# EAGLE design moire_v1.4-wip (EAGLE 9.2.0)

## Sheet 1 of 2
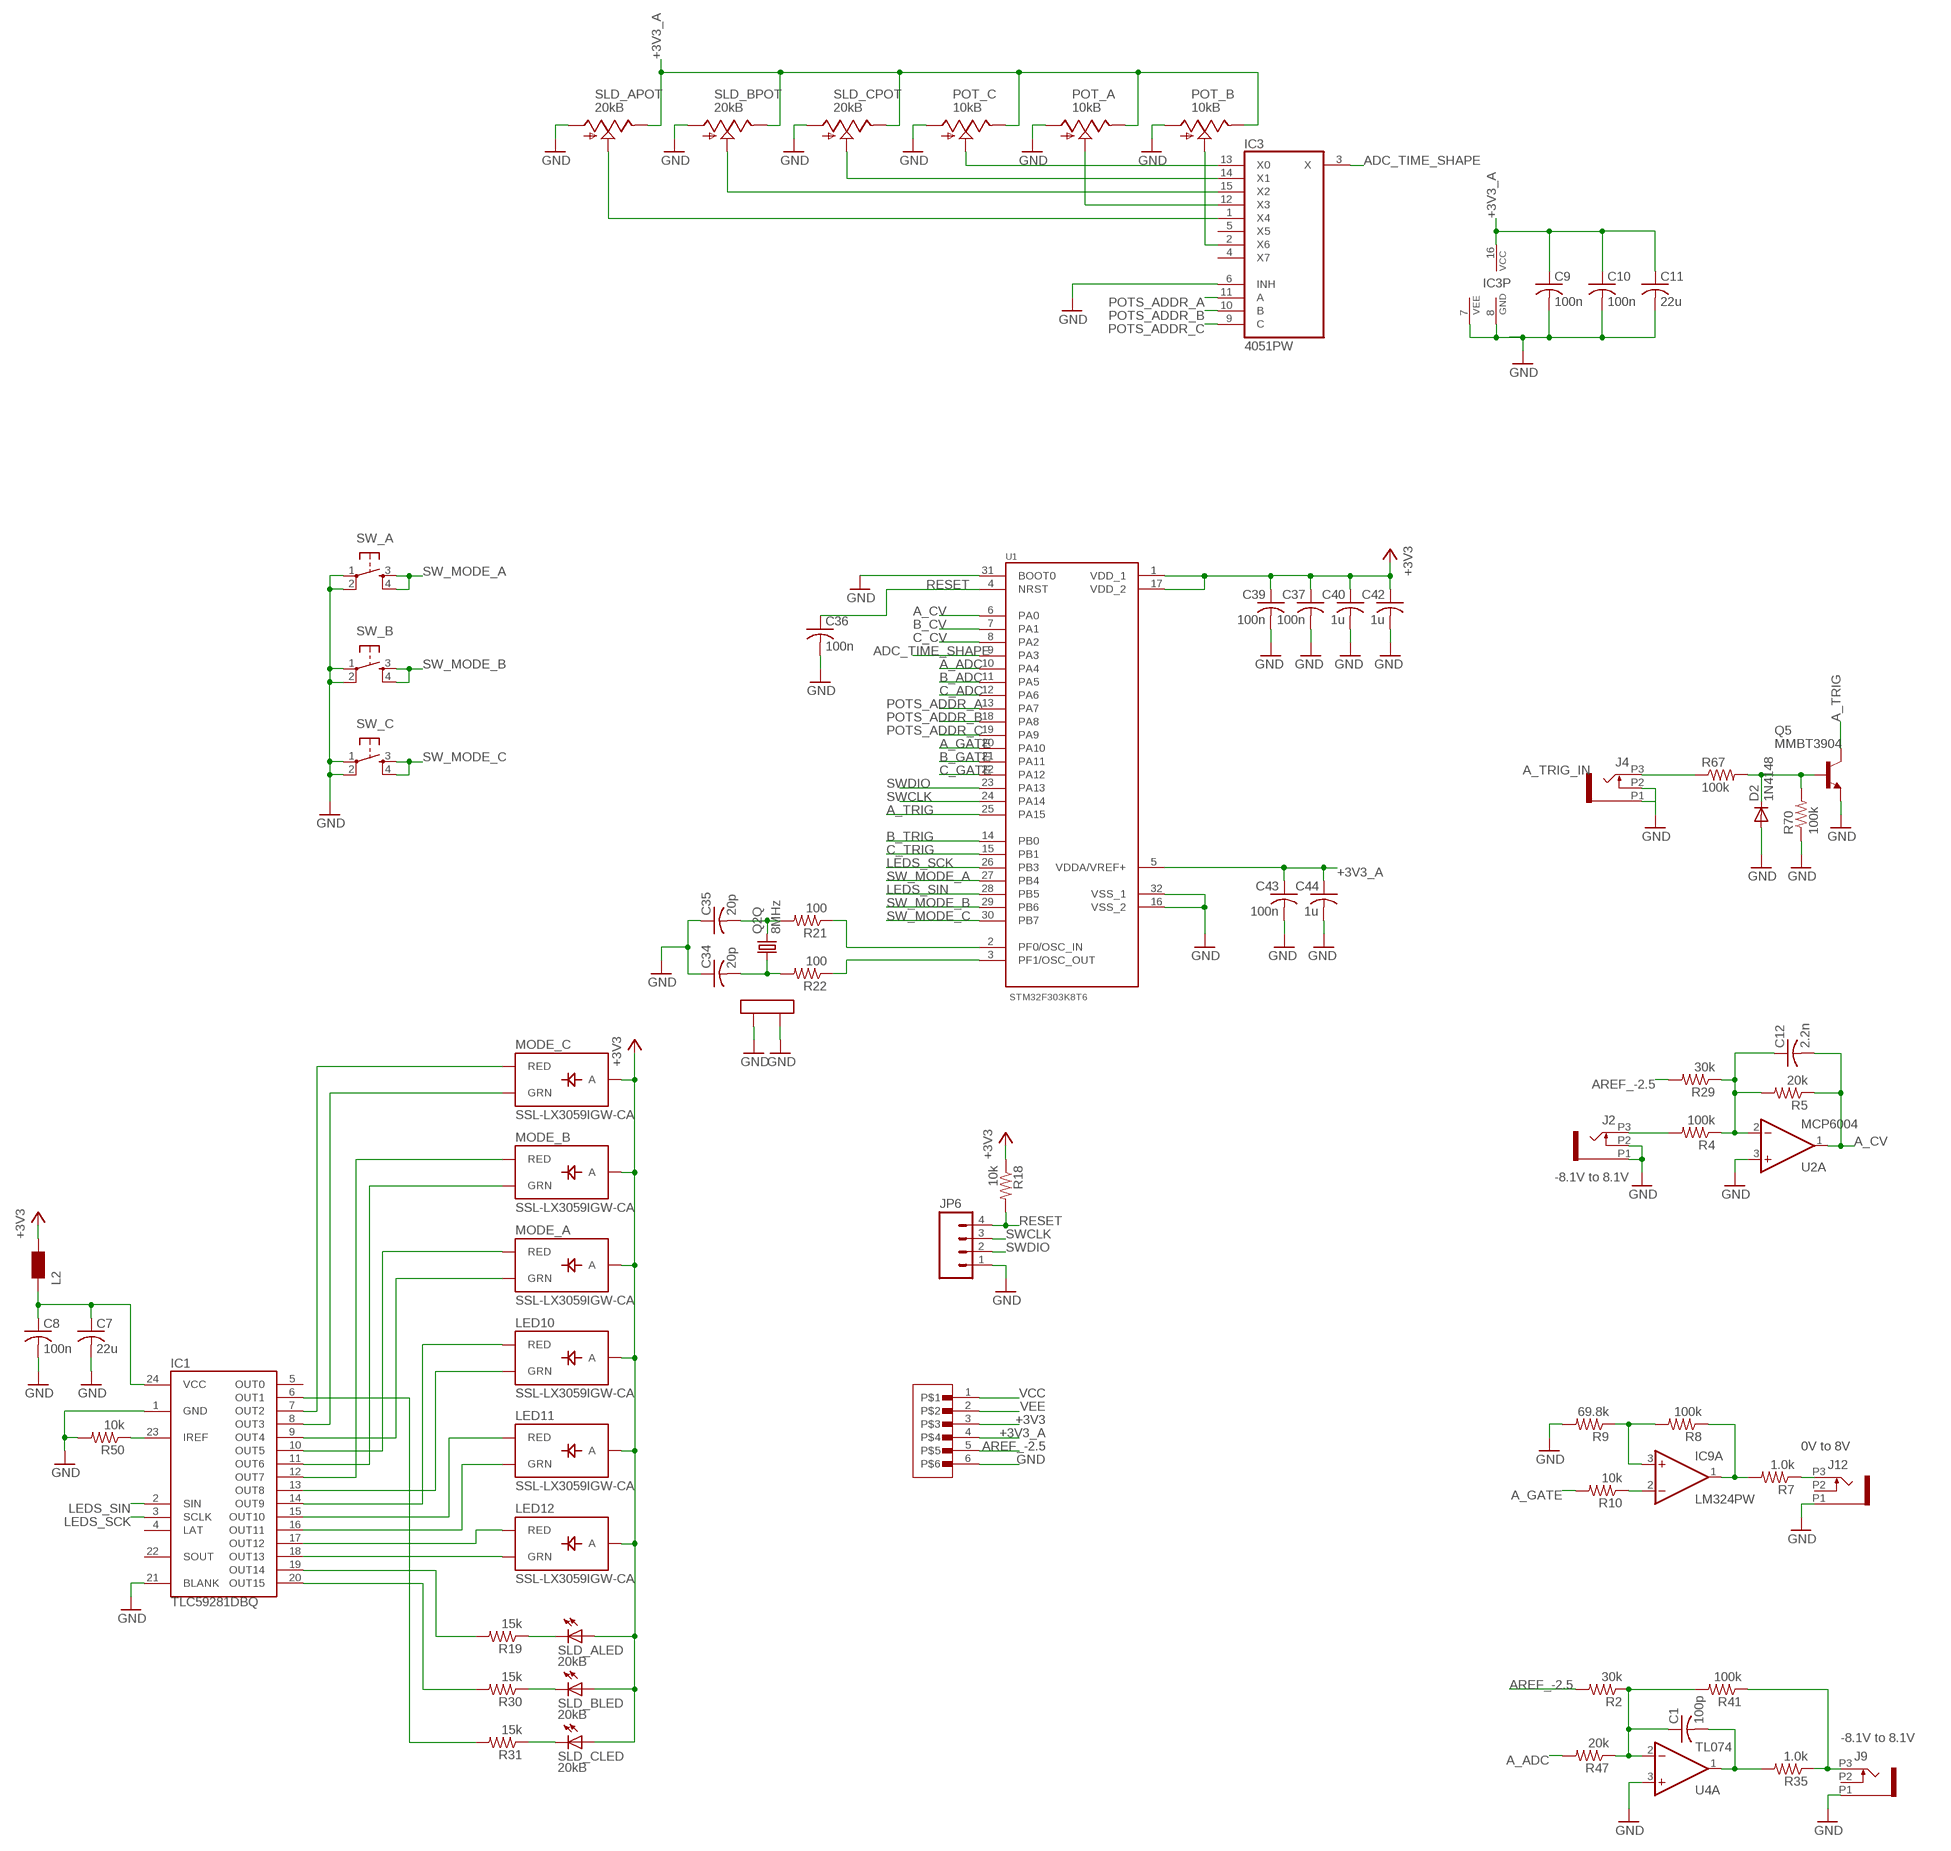
[diagram p0: schematic, sheet 1, part 1 of 2]
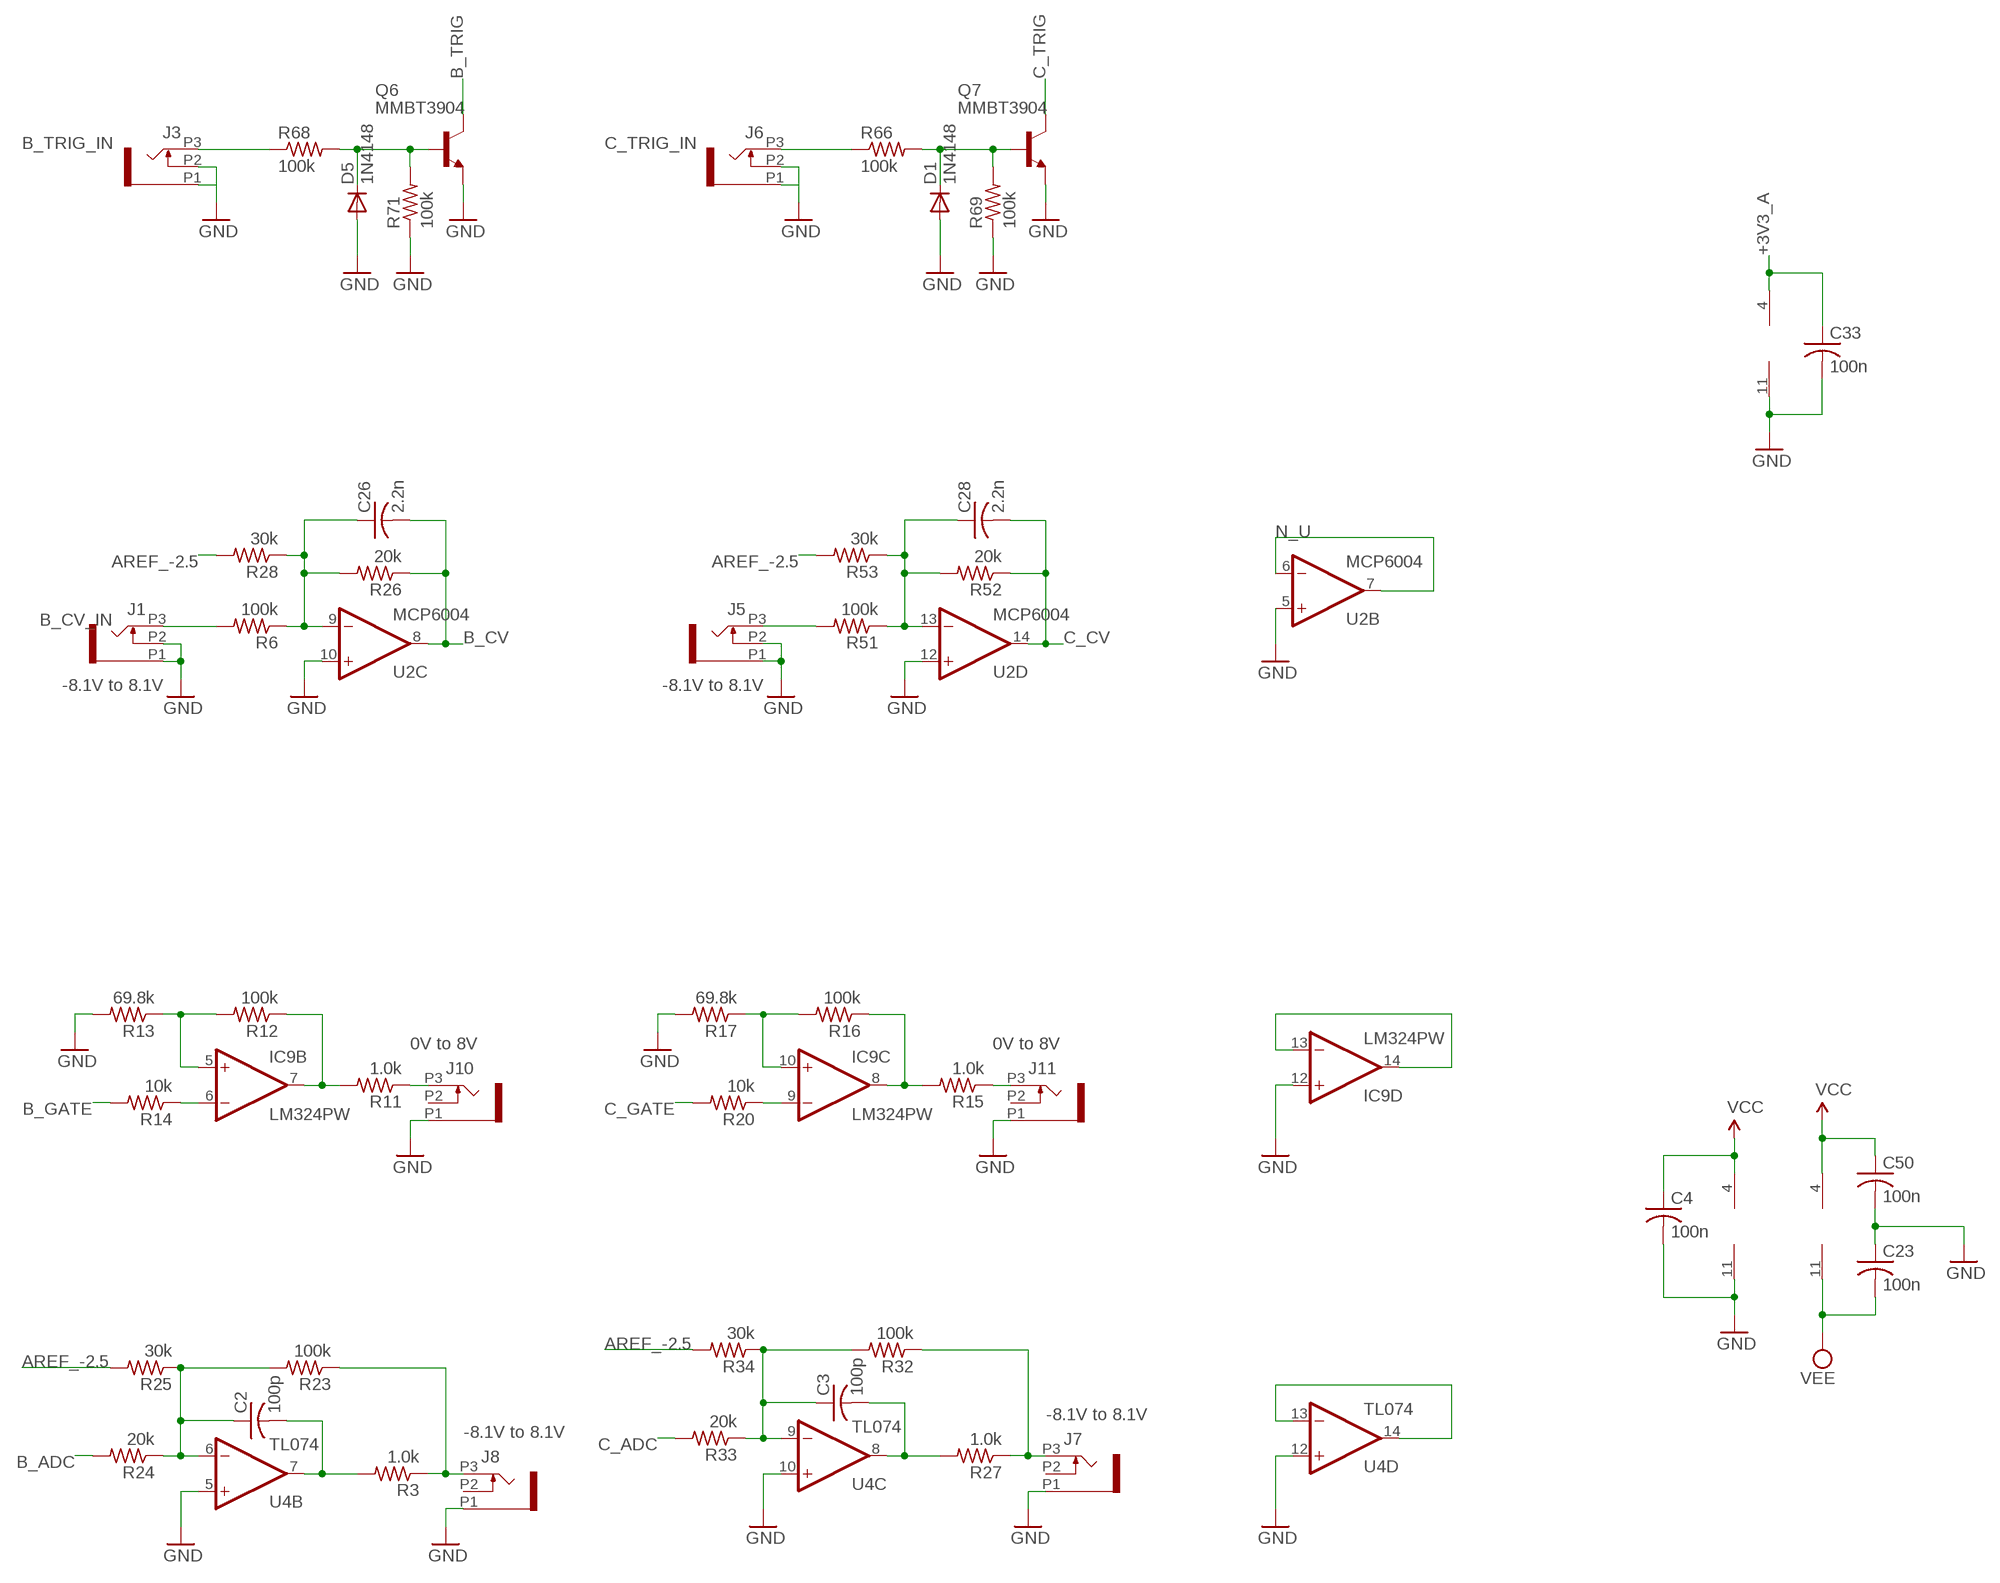
[diagram p1: schematic, sheet 1, part 2 of 2]

### Parts
C1  100p  C-USC0603  [C0603]
C2  100p  C-USC0603  [C0603]
C3  100p  C-USC0603  [C0603]
C4  100n  C-USC0603  [C0603]
C7  22u  C-USC1206  [C1206]
C8  100n  C-USC0603  [C0603]
C9  100n  C-USC0603  [C0603]
C10  100n  C-USC0603  [C0603]
C11  22u  C-USC1206  [C1206]
C12  2.2n  C-USC0603  [C0603]
C23  100n  C-USC0603  [C0603]
C26  2.2n  C-USC0603  [C0603]
C28  2.2n  C-USC0603  [C0603]
C33  100n  C-USC0603  [C0603]
C34  20p  C-USC0603  [C0603]
C35  20p  C-USC0603  [C0603]
C36  100n  C-USC0603  [C0603]
C37  100n  C-USC0603  [C0603]
C39  100n  C-USC0603  [C0603]
C40  1u  C-USC0603  [C0603]
C42  1u  C-USC0603  [C0603]
C43  100n  C-USC0603  [C0603]
C44  1u  C-USC0603  [C0603]
C50  100n  C-USC0603  [C0603]
D1  1N4148  DIODE-SOD523  [SOD523]
D2  1N4148  DIODE-SOD523  [SOD523]
D5  1N4148  DIODE-SOD523  [SOD523]
IC1  TLC59281DBQ  [TSSOP24_0635]
IC3  4051PW  [TSSOP16_065]
IC9  LM324PW  TL074PW  [TSSOP14_065]
J1  PJ301_THONKICONN6  [WQP_PJ_301M6]
J2  PJ301_THONKICONN6  [WQP_PJ_301M6]
J3  PJ301_THONKICONN6  [WQP_PJ_301M6]
J4  PJ301_THONKICONN6  [WQP_PJ_301M6]
J5  PJ301_THONKICONN6  [WQP_PJ_301M6]
J6  PJ301_THONKICONN6  [WQP_PJ_301M6]
J7  PJ301_THONKICONN6  [WQP_PJ_301M6]
J8  PJ301_THONKICONN6  [WQP_PJ_301M6]
J9  PJ301_THONKICONN6  [WQP_PJ_301M6]
J10  PJ301_THONKICONN6  [WQP_PJ_301M6]
J11  PJ301_THONKICONN6  [WQP_PJ_301M6]
J12  PJ301_THONKICONN6  [WQP_PJ_301M6]
JP6  M04PTH  [1X04]
L2  WE-CBF_0603  [0603]
LED10  SSL-LX3059IGW-CA  LED-BICOLOR-THROUGHHOLE-CA  [LED-BICOLOR-THROUGHHOLE-LUMEX]
LED11  SSL-LX3059IGW-CA  LED-BICOLOR-THROUGHHOLE-CA  [LED-BICOLOR-THROUGHHOLE-LUMEX]
LED12  SSL-LX3059IGW-CA  LED-BICOLOR-THROUGHHOLE-CA  [LED-BICOLOR-THROUGHHOLE-LUMEX]
MODE_A  SSL-LX3059IGW-CA  LED-BICOLOR-THROUGHHOLE-CA  [LED-BICOLOR-THROUGHHOLE-LUMEX]
MODE_B  SSL-LX3059IGW-CA  LED-BICOLOR-THROUGHHOLE-CA  [LED-BICOLOR-THROUGHHOLE-LUMEX]
MODE_C  SSL-LX3059IGW-CA  LED-BICOLOR-THROUGHHOLE-CA  [LED-BICOLOR-THROUGHHOLE-LUMEX]
POT_A  10kB  POT_USVERTICAL  [ALPS_POT_VERTICAL]
POT_B  10kB  POT_USVERTICAL  [ALPS_POT_VERTICAL]
POT_C  10kB  POT_USVERTICAL  [ALPS_POT_VERTICAL]
Q2  8MHz  CRYSTAL  [CTS406]
Q5  MMBT3904  MMBT3904LT1-NPN-SOT23-BEC  [SOT23-BEC]
Q6  MMBT3904  MMBT3904LT1-NPN-SOT23-BEC  [SOT23-BEC]
Q7  MMBT3904  MMBT3904LT1-NPN-SOT23-BEC  [SOT23-BEC]
R2  30k  R-US_R0603  [R0603]
R3  1.0k  R-US_R0603  [R0603]
R4  100k  R-US_R0603  [R0603]
R5  20k  R-US_R0603  [R0603]
R6  100k  R-US_R0603  [R0603]
R7  1.0k  R-US_R0603  [R0603]
R8  100k  R-US_R0603  [R0603]
R9  69.8k  R-US_R0603  [R0603]
R10  10k  R-US_R0603  [R0603]
R11  1.0k  R-US_R0603  [R0603]
R12  100k  R-US_R0603  [R0603]
R13  69.8k  R-US_R0603  [R0603]
R14  10k  R-US_R0603  [R0603]
R15  1.0k  R-US_R0603  [R0603]
R16  100k  R-US_R0603  [R0603]
R17  69.8k  R-US_R0603  [R0603]
R18  10k  R-US_R0603  [R0603]
R19  15k  R-US_R0603  [R0603]
R20  10k  R-US_R0603  [R0603]
R21  100  R-US_R0603  [R0603]
R22  100  R-US_R0603  [R0603]
R23  100k  R-US_R0603  [R0603]
R24  20k  R-US_R0603  [R0603]
R25  30k  R-US_R0603  [R0603]
R26  20k  R-US_R0603  [R0603]
R27  1.0k  R-US_R0603  [R0603]
R28  30k  R-US_R0603  [R0603]
R29  30k  R-US_R0603  [R0603]
R30  15k  R-US_R0603  [R0603]
R31  15k  R-US_R0603  [R0603]
R32  100k  R-US_R0603  [R0603]
R33  20k  R-US_R0603  [R0603]
R34  30k  R-US_R0603  [R0603]
R35  1.0k  R-US_R0603  [R0603]
R41  100k  R-US_R0603  [R0603]
R47  20k  R-US_R0603  [R0603]
R50  10k  R-US_R0603  [R0603]
R51  100k  R-US_R0603  [R0603]
R52  20k  R-US_R0603  [R0603]
R53  30k  R-US_R0603  [R0603]
R66  100k  R-US_R0603  [R0603]
R67  100k  R-US_R0603  [R0603]
R68  100k  R-US_R0603  [R0603]
R69  100k  R-US_R0603  [R0603]
R70  100k  R-US_R0603  [R0603]
R71  100k  R-US_R0603  [R0603]
SLD_A  20kB  BOURNS_SLIDER  [BOURNS_SLIDER]
SLD_B  20kB  BOURNS_SLIDER  [BOURNS_SLIDER]
SLD_C  20kB  BOURNS_SLIDER  [BOURNS_SLIDER]
SW_A  TAC_SWITCHPTH  [TACTILE-PTH]
SW_B  TAC_SWITCHPTH  [TACTILE-PTH]
SW_C  TAC_SWITCHPTH  [TACTILE-PTH]
U1  STM32F303K8T6  [QFP80P900X900X160-32N]
U2  MCP6004  MCP6004_SMD  [SO14]
U4  TL074  TL074_SMD  [SO14]
U$1  1X6-SMD-TESTPAD  [6X1-SMD-TESTPAD]

### Nets
+3V3: C37.1 C39.1 C40.1 C42.1 L2.2 LED10.A LED11.A LED12.A MODE_A.A MODE_B.A MODE_C.A R18.1 SLD_A.B(LED:A) SLD_B.B(LED:A) SLD_C.B(LED:A) U1.1(VDD_1) U1.17(VDD_2) U$1.3 ; also sheet 2
+3V3_A: C9.1 C10.1 C11.1 C33.1 C43.1 C44.1 IC3.16(VCC) POT_A.P$1(E) POT_B.P$1(E) POT_C.P$1(E) SLD_A.3(POT:E) SLD_B.3(POT:E) SLD_C.3(POT:E) U1.5(VDDA/VREF+) U2.4(P:V+) U$1.4 ; also sheet 2
A_ADC: R47.2 U1.10(PA4)
A_CV: C12.2 R5.1 U1.6(PA0) U2.1(A:OUT)
A_GATE: R10.2 U1.20(PA10)
A_TRIG: Q5.C U1.25(PA15)
A_TRIG_IN: J4.P3 R67.1
ADC_TIME_SHAPE: IC3.3(X) U1.9(PA3)
AREF_-2.5: R2.2 R25.2 R28.2 R29.2 R34.2 R53.2 U$1.5 ; also sheet 2
B_ADC: R24.2 U1.11(PA5)
B_CV: C26.2 R26.1 U1.7(PA1) U2.8(C:OUT)
B_CV_IN: J1.P3 R6.2
B_GATE: R14.2 U1.21(PA11)
B_TRIG: Q6.C U1.14(PB0)
B_TRIG_IN: J3.P3 R68.1
C_ADC: R33.2 U1.12(PA6)
C_CV: C28.2 R52.1 U1.8(PA2) U2.14(D:OUT)
C_GATE: R20.2 U1.22(PA12)
C_TRIG: Q7.C U1.15(PB1)
C_TRIG_IN: J6.P3 R66.1
GND: C4.2 C7.2 C8.2 C9.2 C10.2 C11.2 C23.1 C33.2 C34.1 C35.1 C36.2 C37.2 C39.2 C40.2 C42.2 C43.2 C44.2 C50.2 D1.A D2.A D5.A IC1.1(GND) IC1.21(BLANK) IC3.6(INH) IC3.7(VEE) IC3.8(GND) IC9.11(P:V-) IC9.12(D:+IN) J1.P1 J1.P2 J2.P1 J2.P2 J3.P1 J3.P2 J4.P1 J4.P2 J5.P1 J5.P2 J6.P1 J6.P2 J7.P1 J8.P1 J9.P1 J10.P1 J11.P1 J12.P1 JP6.1 POT_A.P$3(A) POT_B.P$3(A) POT_C.P$3(A) Q2.2(LID1) Q2.4(LID2) Q5.E Q6.E Q7.E R9.2 R13.2 R17.2 R50.2 R69.1 R70.1 R71.1 SLD_A.1(POT:A) SLD_B.1(POT:A) SLD_C.1(POT:A) SW_A.1 SW_A.2 SW_B.1 SW_B.2 SW_C.1 SW_C.2 U1.16(VSS_2) U1.31(BOOT0) U1.32(VSS_1) U2.3(A:+IN) U2.5(B:+IN) U2.10(C:+IN) U2.11(P:V-) U2.12(D:+IN) U4.3(A:+IN) U4.5(B:+IN) U4.10(C:+IN) U4.12(D:+IN) U$1.6 ; also sheet 2
LEDS_SCK: IC1.3(SCLK) U1.26(PB3)
LEDS_SIN: IC1.2(SIN) U1.28(PB5)
N$1: R31.1 SLD_C.E(LED:C)
N$2: J12.P3 R7.1
N$6: IC9.13(D:-IN) IC9.14(D:OUT)
N$7: J8.P3 R3.1 R23.1
N$8: C2.1 R23.2 R24.1 R25.1 U4.6(B:-IN)
N$9: R21.1 U1.2(PF0/OSC_IN)
N$10: R22.1 U1.3(PF1/OSC_OUT)
N$11: C35.2 Q2.3 R21.2
N$12: C34.2 Q2.1 R22.2
N$13: J10.P3 R11.1
N$14: U4.13(D:-IN) U4.14(D:OUT)
N$15: C2.2 R3.2 U4.7(B:OUT)
N$16: IC9.1(A:OUT) R7.2 R8.1
N$17: J7.P3 R27.1 R32.1
N$18: C3.1 R32.2 R33.1 R34.1 U4.9(C:-IN)
N$19: C3.2 R27.2 U4.8(C:OUT)
N$20: J11.P3 R15.1
N$21: J5.P3 R51.2
N$22: J2.P3 R4.2
N$24: IC9.3(A:+IN) R8.2 R9.1
N$25: IC9.2(A:-IN) R10.1
N$26: IC9.7(B:OUT) R11.2 R12.1
N$28: IC9.5(B:+IN) R12.2 R13.1
N$29: IC9.6(B:-IN) R14.1
N$30: IC9.8(C:OUT) R15.2 R16.1
N$32: IC1.11(OUT6) MODE_B.GREEN_C(GRN)
N$33: IC1.10(OUT5) MODE_A.RED_C(RED)
N$34: IC1.12(OUT7) MODE_B.RED_C(RED)
N$35: IC1.7(OUT2) MODE_C.RED_C(RED)
N$36: IC1.8(OUT3) MODE_C.GREEN_C(GRN)
N$37: IC1.15(OUT10) LED11.RED_C(RED)
N$38: IC1.16(OUT11) LED11.GREEN_C(GRN)
N$39: IC1.13(OUT8) LED10.GREEN_C(GRN)
N$40: IC1.17(OUT12) LED12.RED_C(RED)
N$41: D1.C Q7.B R66.2 R69.2
N$42: IC1.18(OUT13) LED12.GREEN_C(GRN)
N$43: IC1.14(OUT9) LED10.RED_C(RED)
N$44: C7.1 C8.1 IC1.24(VCC) L2.1
N$45: IC1.19(OUT14) R19.2
N$46: IC1.20(OUT15) R30.2
N$47: IC1.6(OUT1) R31.2
N$48: IC3.1(X4) SLD_A.2(POT:S)
N$49: R30.1 SLD_B.E(LED:C)
N$50: R19.1 SLD_A.E(LED:C)
N$51: IC3.2(X6) POT_B.P$2(S)
N$53: IC3.12(X3) POT_A.P$2(S)
N$54: IC3.13(X0) POT_C.P$2(S)
N$55: IC3.14(X1) SLD_C.2(POT:S)
N$56: IC3.15(X2) SLD_B.2(POT:S)
N$57: C12.1 R4.1 R5.2 R29.1 U2.2(A:-IN)
N$58: C26.1 R6.1 R26.2 R28.1 U2.9(C:-IN)
N$59: C28.1 R51.1 R52.2 R53.1 U2.13(D:-IN)
N$61: IC9.10(C:+IN) R16.2 R17.1
N$62: D5.C Q6.B R68.2 R71.2
N$64: IC9.9(C:-IN) R20.1
N$65: D2.C Q5.B R67.2 R70.2
N$68: IC1.23(IREF) R50.1
N$86: J9.P3 R35.1 R41.1
N$87: C1.1 R2.1 R41.2 R47.1 U4.2(A:-IN)
N$93: C1.2 R35.2 U4.1(A:OUT)
N$101: IC1.9(OUT4) MODE_A.GREEN_C(GRN)
N_U: U2.6(B:-IN) U2.7(B:OUT)
POTS_ADDR_A: IC3.11(A) U1.13(PA7)
POTS_ADDR_B: IC3.10(B) U1.18(PA8)
POTS_ADDR_C: IC3.9(C) U1.19(PA9)
RESET: C36.1 JP6.4 R18.2 U1.4(NRST)
SW_MODE_A: SW_A.3 SW_A.4 U1.27(PB4)
SW_MODE_B: SW_B.3 SW_B.4 U1.29(PB6)
SW_MODE_C: SW_C.3 SW_C.4 U1.30(PB7)
SWCLK: JP6.3 U1.24(PA14)
SWDIO: JP6.2 U1.23(PA13)
VCC: C4.1 C50.1 IC9.4(P:V+) U4.4(P:V+) U$1.1 ; also sheet 2
VEE: C23.2 U4.11(P:V-) U$1.2 ; also sheet 2
Unconnected: IC1.4(LAT) IC1.5(OUT0) IC1.22(SOUT) IC3.4(X7) IC3.5(X5) J7.P2 J8.P2 J9.P2 J10.P2 J11.P2 J12.P2

### Notes on the sheet
- -8.1V to 8.1V | -8.1V to 8.1V | -8.1V to 8.1V
- 0V to 8V | 0V to 8V | 0V to 8V
- -8.1V to 8.1V
- -8.1V to 8.1V | -8.1V to 8.1V

## Sheet 2 of 2
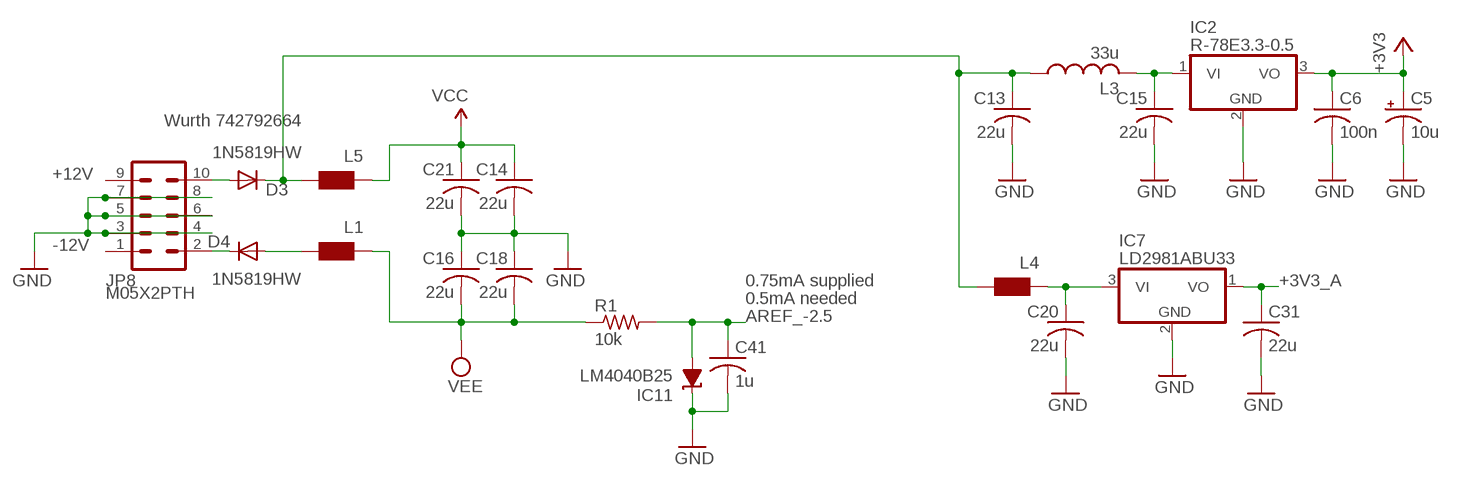
[diagram p2: schematic, sheet 2]

### Parts
C5  10u  CPOL-USA  [PANASONIC_A]
C6  100n  C-USC0603  [C0603]
C13  22u  C-USC1206  [C1206]
C14  22u  C-USC1206  [C1206]
C15  22u  C-USC1206  [C1206]
C16  22u  C-USC1206  [C1206]
C18  22u  C-USC1206  [C1206]
C20  22u  C-USC1206  [C1206]
C21  22u  C-USC1206  [C1206]
C31  22u  C-USC1206  [C1206]
C41  1u  C-USC0603  [C0603]
D3  1N5819HW  DIODE-SOD123  [SOD123]
D4  1N5819HW  DIODE-SOD123  [SOD123]
IC2  R-78E3.3-0.5  WE173950378  [WE78]
IC7  LD2981ABU33  LD2981ABU  [SOT89]
IC11  LM4040B25  LM4041B12DBZ  [DBZ_R-PDSO-G3]
JP8  M05X2PTH  [2X5-PTH]
L1  WE-CBF_0603  [0603]
L3  33u  L-USL2012C  [L2012C]
L4  WE-CBF_0603  [0603]
L5  WE-CBF_0603  [0603]
R1  10k  R-US_R0603  [R0603]

### Nets
+3V3: C5.+ C6.1 IC2.3(VO) ; also sheet 1
+3V3_A: C31.1 IC7.1(VO) ; also sheet 1
+12V: D3.A JP8.9 JP8.10
-12V: D4.C JP8.1 JP8.2
AREF_-2.5: C41.1 IC11.2(A) R1.2 ; also sheet 1
GND: C5.- C6.2 C13.2 C14.2 C15.2 C16.1 C18.1 C20.2 C21.2 C31.2 C41.2 IC2.2(GND) IC7.2(GND) IC11.1(C) JP8.3 JP8.4 JP8.5 JP8.6 JP8.7 JP8.8 ; also sheet 1
N$3: D4.A L1.2
N$4: C13.1 D3.C L3.1 L4.2 L5.2
N$5: C20.1 IC7.3(VI) L4.1
N$66: C15.1 IC2.1(VI) L3.2
VCC: C14.1 C21.1 L5.1 ; also sheet 1
VEE: C16.2 C18.2 L1.1 R1.1 ; also sheet 1

### Notes on the sheet
- Wurth 742792664
- 0.75mA supplied
- 0.5mA needed

## Library data of the parts
C1-C4 C6-C16 C18 C20 C21 C23 C26 C28 C31 C33-C37 C39-C44 C50 = rcl:C-US: CAPACITOR, American symbol
C5 = rcl:CPOL-US: POLARIZED CAPACITOR, American symbol
D1-D5 = diode:DIODE-: DIODE
IC1 = og-ics:TLC59281
IC2 = og-vreg:WE173950378
IC3 = og-ics:4051: 8-channel ANALOG MULTIPLEXER
IC7 = og-vreg:LD2981
IC9 = og-linear:TL074: OP AMP
IC11 = texas:LM4041: PRECISION MICROPOWER SHUNT VOLTAGE REFERENCE Source: http://focus.ti.com/lit/ds/slcs146e/slcs146e.pdf
J1-J12 = og-pj301_variations:PJ301_THONKICONN
JP6 = SparkFun:M04: Header 4 Standard 4-pin 0.1" header. Use with straight break away headers (SKU : PRT-00116), right angle break away headers (PRT-00553), swiss pins (PRT-00743), machine pins (PRT-00117), and female headers (PRT-00115). Molex polarized connector foot print use with SKU : PRT-08231 with associated crimp pins and housings.
JP8 = og-header:M05X2: Header 5x2 Standard 10-pin dual row 0.1" header. Commonly used with AVR-ISP. Use with Spark Fun Electronics SKU: PRT-00778
L1 L2 L4 L5 = wuerth-elektronik:WE-CBF: SMD EMI Suppression Ferrite Beads - excellent anti-EMI properties - low DCR - impedances till 3000 ohms - rated current up to 6 A
L3 = og-rcl:L-US
LED10-LED12 MODE_A MODE_B MODE_C = og-leds:LED-BICOLOR-THROUGHHOLE-CA
POT_A POT_B POT_C = og-pots:POT_US
Q2 = og-crystal:CRYSTAL: Crystal with 2 extra terminals for the metal LID (Abracon ABMM2 for example)
Q5-Q7 = transistor:*-NPN-: NPN Transistror BF959 corrected 2008.03.06
R1-R35 R41 R47 R50-R53 R66-R71 = rcl:R-US_: RESISTOR, American symbol
SLD_A SLD_B SLD_C = og-pots:BOURNS_SLIDER
SW_A SW_B SW_C = SparkFun:TAC_SWITCH: Momentary Switch Button commonly used for reset or general input. Spark Fun Electronics SKU : COM-00097
U1 = STM32F303K8T6:STM32F303K8T6: Analog and DSP with FPU ARM Cortex-M4 MCU with 64 Kbytes Flash, 72 MHz CPU, CCM, 12-bit ADC 5 MSPS, comparators, op-amp; AVAILABILITY: Unavailable; DESCRIPTION: Analog and DSP with FPU ARM Cortex-M4 MCU with 64 Kbytes Flash, 72 MHz CPU, CCM, 12-bit ADC 5 MSPS, comparators, op-amp; MF: STMicroelectronics; MP: STM32F303K8T6; PACKAGE: LQFP-32 STMicroelectronics; PRICE: None
U2 = MusicThingModular:MCP6004: Generic Quad Op Amp
U4 = MusicThingModular:TL074: Generic Quad Op Amp
U$1 = CUSTOM:1X6-SMD-TESTPAD

## Board
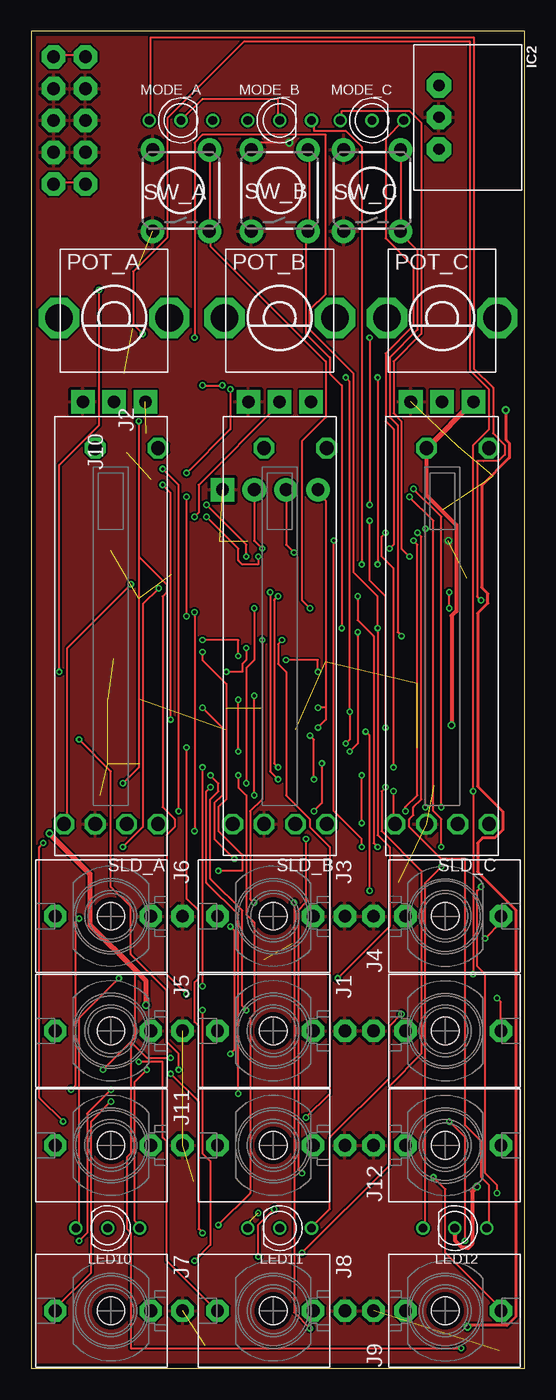
[diagram p3: board, top side]
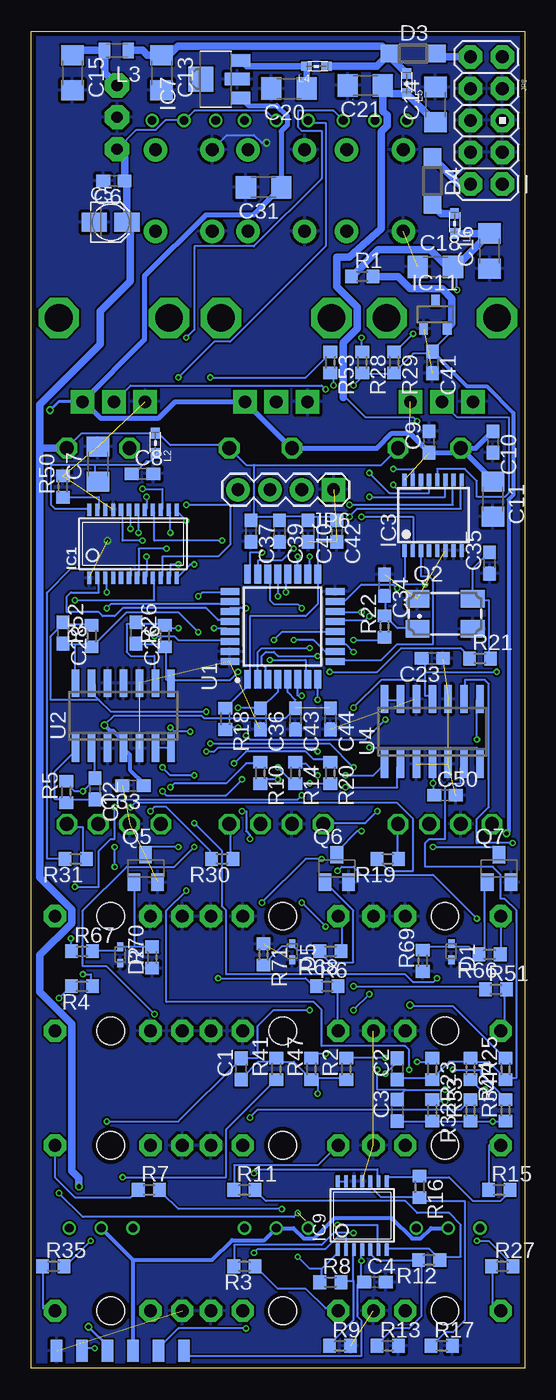
[diagram p4: board, bottom side, seen from below]

Size 39.35 x 106.68 mm. Coordinates in mm from the lower left corner, seen from the top.
Outline: 0,0 39.35,0 39.35,106.68 0,106.68 0,0
Copper layers (1*16): Top 0.035559375mm / dielectric 1.6mm / Bottom 0.035559375mm
Design rules "oshpark-2layer *": minimum track width 6mil, minimum drill 10mil, track to track 6mil, track to pad 6mil, pad to pad 6mil, via to via 6mil, smd to smd 0mil, copper to edge 15mil, drill to drill 6mil, minimum pad ring 5mil, minimum via ring 5mil, stop-mask expansion 2.5mil, vias tented up to drill 0mil, thermal gap 10mil

### Footprints (pad centres in the part's own frame; a part is rotated, then mirrored left to right if it is on the bottom)
C0603 = smd 1.1 x 1: 1 -0.85,0; 2 0.85,0
PANASONIC_A = smd 2 x 1.5: + 1.3,0; - -1.3,0
C1206 = smd 1.6 x 1.8: 1 -1.4,0; 2 1.4,0
SOD523 = smd 0.7 x 0.5: A 0.7,0; C -0.6,0
SOD123 = smd 1.4 x 1.4: A 1.9,0; C -1.9,0
TSSOP24_0635 = smd 0.33 x 1: 1 -3.493,-2.725; 2 -2.857,-2.725; 3 -2.223,-2.725; 4 -1.587,-2.725; 5 -0.953,-2.725; 6 -0.318,-2.725; 7 0.318,-2.725; 8 0.953,-2.725; 9 1.587,-2.725; 10 2.223,-2.725; 11 2.857,-2.725; 12 3.493,-2.725; 13 3.493,2.725; 14 2.857,2.725; 15 2.223,2.725; 16 1.587,2.725; 17 0.953,2.725; 18 0.318,2.725; 19 -0.318,2.725; 20 -0.953,2.725; 21 -1.587,2.725; 22 -2.223,2.725; 23 -2.857,2.725; 24 -3.493,2.725
WE78 = drill 0.9 pad 1.93 octagon: 1 -2.54,0; 2 0,0; 3 2.54,0
TSSOP16_065 = smd 0.35 x 1: 1 -1.95,-2.825; 2 -1.3,-2.825; 3 -0.65,-2.825; 4 0,-2.825; 5 0.65,-2.825; 6 1.3,-2.825; 7 1.95,-2.825; 8 2.6,-2.825; 9 2.6,2.825; 10 1.95,2.825; 11 1.3,2.825; 12 0.65,2.825; 13 0,2.825; 14 -0.65,2.825; 15 -1.3,2.825; 16 -1.95,2.825
SOT89 = smd 1 x 1.5: 1 -1.499,-1.981; 3 1.499,-1.981 | smd 1 x 2: 2 0,-1.727 | smd 2 x 2: 2@1 0,1.194
TSSOP14_065 = smd 0.305 x 0.991: 1 -1.95,-2.718; 2 -1.3,-2.718; 3 -0.65,-2.718; 4 0,-2.718; 5 0.65,-2.718; 6 1.3,-2.718; 7 1.95,-2.718; 8 1.95,2.718; 9 1.3,2.718; 10 0.65,2.718; 11 0,2.718; 12 -0.65,2.718; 13 -1.3,2.718; 14 -1.95,2.718
DBZ_R-PDSO-G3 = smd 0.7 x 1: 1 -0.95,-1.1; 2 0.95,-1.1; 3 0,1.1
WQP_PJ_301M6 = drill 1.016 pad 1.778 octagon: P1 0,-5.715; P2 0,-3.175; P3 0,4.445 | hole 2.2: 0,0
1X04 = drill 1.016 pad 1.88 square: 1 0,0 | drill 1.016 pad 1.88: 2 2.54,0; 3 5.08,0; 4 7.62,0
2X5-PTH = drill 1.016 pad 1.88 octagon: 1 -1.27,5.08; 2 1.27,5.08; 3 -1.27,2.54; 4 1.27,2.54; 5 -1.27,0; 6 1.27,0; 7 -1.27,-2.54; 8 1.27,-2.54; 9 -1.27,-5.08; 10 1.27,-5.08
0603 = smd 0.85 x 0.7: 1 -0.9,0; 2 0.7,0
L2012C = smd 0.9 x 1.25: 1 -0.9,0; 2 1,0
LED-BICOLOR-THROUGHHOLE-LUMEX = drill 0.7: A 0,0; GREEN_C 2.54,0; RED_C -2.54,0
ALPS_POT_VERTICAL = drill 1 pad 1.88 square: P$1 -2.5,6.7; P$2 0,6.7; P$3 2.5,6.7 | drill 2.2 pad 3.175 octagon: P$4 -4.4,0; P$5 4.4,0
CTS406 = smd 1.9 x 1.4: 1 -2.2,-1.2; 2 2.2,-1.2; 3 2.2,1.2; 4 -2.2,1.2
SOT23-BEC = smd 1 x 1.4: B -0.95,-1.1; C 0,1.1; E 0.95,-1.1
R0603 = smd 1 x 1.1: 1 -0.85,0; 2 0.85,0
BOURNS_SLIDER = drill 1.1 octagon: 1 -15,1.25; 2 -15,3.75; 3 15,1.25; B 15,-3.75; DUMMY -15,-1.25; E -15,-3.75
TACTILE-PTH = drill 1.016 pad 1.88: 1 -3.251,2.261; 2 3.251,2.261; 3 -3.251,-2.261; 4 3.251,-2.261
QFP80P900X900X160-32N = smd 1.5 x 0.55: 1 -4.2,2.8; 2 -4.2,2; 3 -4.2,1.2; 4 -4.2,0.4; 5 -4.2,-0.4; 6 -4.2,-1.2; 7 -4.2,-2; 8 -4.2,-2.8; 17 4.2,-2.8; 18 4.2,-2; 19 4.2,-1.2; 20 4.2,-0.4; 21 4.2,0.4; 22 4.2,1.2; 23 4.2,2; 24 4.2,2.8 | smd 0.55 x 1.5: 9 -2.8,-4.2; 10 -2,-4.2; 11 -1.2,-4.2; 12 -0.4,-4.2; 13 0.4,-4.2; 14 1.2,-4.2; 15 2,-4.2; 16 2.8,-4.2; 25 2.8,4.2; 26 2,4.2; 27 1.2,4.2; 28 0.4,4.2; 29 -0.4,4.2; 30 -1.2,4.2; 31 -2,4.2; 32 -2.8,4.2
SO14 = smd 0.6 x 2.2: 1 -3.81,-2.6; 2 -2.54,-2.6; 3 -1.27,-2.6; 4 0,-2.6; 5 1.27,-2.6; 6 2.54,-2.6; 7 3.81,-2.6; 8 3.81,2.6; 9 2.54,2.6; 10 1.27,2.6; 11 0,2.6; 12 -1.27,2.6; 13 -2.54,2.6; 14 -3.81,2.6
6X1-SMD-TESTPAD = smd 0.914 x 1.778: 1 0,0.123; 2 -2.032,0.123; 3 -4.064,0.123; 4 -6.096,0.123; 5 -8.128,0.123; 6 -10.16,0.123

### Placement (x,y rotation side)
C1  22.61,23.88 90 bottom
C2  10.16,23.88 90 bottom
C3  10.16,20.57 90 bottom
C4  11.94,6.86 0 bottom
C5  33.02,91.44 0 bottom
C6  32.77,94.74 180 bottom
C7  34.04,72.14 90 bottom
C8  30.48,71.37 0 bottom
C9  7.62,73.91 90 bottom
C10  2.54,73.91 270 bottom
C11  2.54,69.34 270 bottom
C12  34.29,46.23 270 bottom
C13  28.96,103.38 270 bottom
C14  7.11,100.84 90 bottom
C15  36.07,103.38 270 bottom
C16  2.79,89.15 90 bottom
C18  7.11,87.88 0 bottom
C20  18.8,102.11 180 bottom
C21  12.7,102.36 180 bottom
C23  7.37,56.64 180 bottom
C26  30.99,58.67 270 bottom
C28  36.83,58.67 270 bottom
C31  20.83,94.23 180 bottom
C33  31.24,46.48 180 bottom
C34  11.18,62.48 270 bottom
C35  2.79,64.26 90 bottom
C36  21.08,51.82 270 bottom
C37  21.84,66.8 270 bottom
C39  19.56,66.8 270 bottom
C40  17.27,66.8 270 bottom
C41  7.37,80.26 270 bottom
C42  14.99,66.8 270 bottom
C43  18.29,51.82 270 bottom
C44  15.49,51.82 270 bottom
C50  6.35,45.72 0 bottom
D1  5.84,33.27 270 bottom
D2  32.26,33.02 270 bottom
D3  8.89,104.9 0 bottom
D4  7.37,94.74 270 bottom
D5  18.54,33.27 270 bottom
IC1  31.24,65.79 0 bottom
IC2  32.51,99.82 270 top
IC3  7.62,68.07 0 bottom
IC7  24.64,102.87 90 bottom
IC9  12.95,12.19 0 bottom
IC11  7.11,84.07 0 bottom
J1  19.3,26.92 90 top
J2  33.02,26.92 270 top
J3  19.3,36.07 90 top
J4  33.02,36.07 270 top
J5  6.35,26.92 90 top
J6  6.35,36.07 90 top
J7  6.35,4.57 90 top
J8  19.3,4.57 90 top
J9  33.02,4.57 270 top
J10  19.3,17.78 90 top
J11  6.35,17.78 90 top
J12  33.02,17.78 270 top
JP6  15.24,70.1 180 bottom
JP8  3.05,99.57 180 bottom
L1  5.59,91.44 90 bottom
L2  29.46,73.91 90 bottom
L3  32.51,105.16 180 bottom
L4  16.51,103.89 0 bottom
L5  9.4,102.62 90 bottom
LED10  6.1,11.18 0 top
LED11  19.81,11.18 0 top
LED12  33.78,11.18 0 top
MODE_A  11.94,99.57 180 top
MODE_B  19.81,99.57 180 top
MODE_C  27.18,99.57 180 top
POT_A  6.6,83.82 180 top
POT_B  19.81,83.82 180 top
POT_C  32.77,83.82 180 top
Q2  6.35,60.2 0 bottom
Q5  30.23,39.88 0 bottom
Q6  14.99,39.88 0 bottom
Q7  2.03,39.88 0 bottom
R1  12.95,87.12 0 bottom
R2  14.22,23.88 90 bottom
R3  22.35,8.13 180 bottom
R4  35.31,30.48 180 bottom
R5  36.58,45.97 90 bottom
R6  15.75,30.48 0 bottom
R7  29.97,14.22 0 bottom
R8  15.49,6.86 0 bottom
R9  14.73,1.78 0 bottom
R10  21.08,47.5 270 bottom
R11  22.35,14.22 0 bottom
R12  7.62,8.64 180 bottom
R13  10.92,1.78 0 bottom
R14  18.29,47.5 270 bottom
R15  2.03,14.22 0 bottom
R16  8.38,14.48 270 bottom
R17  6.6,1.78 0 bottom
R18  23.88,51.82 270 bottom
R19  10.92,40.64 180 bottom
R20  15.49,47.5 270 bottom
R21  3.56,56.64 0 bottom
R22  11.18,59.18 90 bottom
R23  7.37,23.88 270 bottom
R24  4.32,23.88 270 bottom
R25  1.52,23.88 90 bottom
R26  28.7,58.42 90 bottom
R27  1.78,8.13 0 bottom
R28  12.95,80.26 270 bottom
R29  10.41,80.26 270 bottom
R30  24.13,40.64 180 bottom
R31  35.81,40.64 180 bottom
R32  7.37,20.57 270 bottom
R33  4.32,20.57 90 bottom
R34  1.52,20.57 90 bottom
R35  37.59,8.13 0 bottom
R41  19.81,23.88 90 bottom
R47  17.02,23.88 90 bottom
R50  36.83,70.36 90 bottom
R51  2.29,30.23 0 bottom
R52  34.54,58.42 90 bottom
R53  15.49,80.26 270 bottom
R66  2.79,33.02 180 bottom
R67  35.31,33.27 0 bottom
R68  15.49,33.27 180 bottom
R69  8.13,32.51 90 bottom
R70  29.72,32.77 90 bottom
R71  20.83,33.02 270 bottom
SLD_A  6.35,58.42 90 top
SLD_B  19.81,58.42 90 top
SLD_C  32.77,58.42 90 top
SW_A  11.94,93.98 90 top
SW_B  19.81,93.98 90 top
SW_C  27.18,93.98 90 top
U1  19.3,59.18 90 bottom
U2  32,52.07 0 bottom
U4  7.37,50.8 0 bottom
U$1  27.18,1.27 0 bottom

### Tracks (layer width: path | path; a pad name or v marks a point on that pad's centre or on a via)
+3V3  (via drill 0.35)  (1 unrouted)
  Top 0.152: 13.72,101.28 19.68,101.28 19.68,99.69 MODE_B.A | 35.56,14.61 v35.56,14.48 | 13.65,101.28 MODE_A.A
  Top 0.305: v35.56,14.48 35.17,14.08 35.17,9.93 34.84,9.6 34.38,9.6 33.78,10.2 LED12.A
  Bottom 0.152: 31.43,1.59 U$1.3 | R18.1 23.81,52.7 21.91,54.61 21.91,54.93 U1.1 21.91,55.24 21.91,60.01 17.46,60.01 16.51,60.96 16.51,63.18 U1.17 16.51,63.5 16.51,67.94 | 21.59,67.94 19.68,67.94 C39.1 19.37,67.94 17.46,67.94 C40.1 17.14,67.94 16.51,67.94 | 16.51,67.94 15.24,67.94 C42.1 | L2.2 29.21,74.61 28.26,73.66 23.81,73.66 SLD_B.B 23.5,73.34 22.23,72.07 21.59,72.07 | 21.59,72.07 11.43,72.07 10.16,73.34 SLD_A.B | 21.59,72.07 21.59,67.94 | 21.59,67.94 C37.1 | 29.53,74.93 L2.2 | SLD_C.B 35.32,74.61 L2.2 | IC2.3 30.98,98.81 29.41,98.81 28.65,99.57 MODE_C.A 26.99,99.69 26.35,100.33 20.64,100.33 20,99.69 19.94,99.69 MODE_B.A
  Bottom 0.305: LED12.A 31.24,8.64 | 31.24,8.64 U$1.3 | 31.24,8.64 24.92,8.64 23.34,10.22 20.77,10.22 LED11.A 18.45,11.18 17.62,10.35 16.8,10.35 15.15,11.99 10.62,11.99 8.98,10.35 8.29,10.35 7.46,11.18 LED10.A
  Bottom 0.61: 38.66,73.41 38.66,39.17 36.12,36.63 36.12,35.51 38.66,32.97 38.66,30.03 36.12,27.48 36.12,15.75 35.56,15.19 v35.56,14.48 | 38.66,73.41 36.53,73.41 SLD_C.B | IC2.3 31.92,96.69 C6.1 31.72,94.55 C5.+ 31.47,91.19 31.47,86.76 33.87,84.36 33.87,81.7 38.66,76.91 38.66,73.41
+3V3_A  (via drill 0.35)  (3 unrouted)
  Top 0.254: v37.85,76.45 37.85,74.1 38.14,73.81 38.14,72.66 35.92,70.43 35.92,62.31 36.41,61.81 36.41,61.06 35.6,60.24 35.6,46.44 37.62,44.41 37.62,42.96 36.97,42.32 36,42.32 35.6,41.91 35.6,39.61 38.63,36.58 38.63,4.09 37.95,3.4 34.9,3.4 v34.8,3.3
  Top 0.305: SLD_C.3 31.52,69.67 33.9,67.29 33.9,60.41 33.53,60.04 v33.53,51.31
  Top 0.406: POT_C.P$1 31.57,73.42 SLD_C.3
  Bottom 0.152: v33.53,51.31 32.75,52.08 25.78,52.08 25.58,51.89 19.07,51.89 C43.1 18.29,53.34 18.9,53.96 U1.5
  Bottom 0.254: POT_C.P$1 37.18,77.12 v37.85,76.45 | v34.8,3.3 33.27,1.78 U$1.4
  Bottom 0.305: v33.53,51.31 33.09,50.88 32.85,50.88 32,50.03 U2.4 31.5,48.96 31.5,47.75 30.39,46.65 C33.1
  Bottom 0.406: IC7.1 22.05,100.76 19.76,100.76 18.93,99.93 18.93,99.2 19.43,98.71 C31.1 21.64,92.02 25.45,92.02 30.33,87.15 30.33,82.06 POT_C.P$1 35.15,77.12 33.85,75.83 29.18,75.83 27.88,77.12 POT_B.P$1 18.61,73.42 SLD_B.3 11.77,73.42 10.59,74.6 9.16,74.6 C9.1 5.46,73.06 SLD_A.3 | SLD_A.3 3.88,73.42 C10.1 | SLD_A.3 2.54,70.86 C11.1
+12V
  Top 0.152: JP8.9 1.91,104.78 4.13,104.78 JP8.10
  Bottom 0.61: JP8.10 6.74,104.65 D3.A
-12V
  Top 0.152: JP8.1 1.91,94.61 4.13,94.61 JP8.2
  Bottom 0.61: JP8.2 5.21,94.49 D4.C
A_ADC  (via drill 0.25)
  Top 0.152: v15.88,25.08 16.19,25.4 16.19,34.92 v15.88,35.24 | v17.78,37.15 17.46,37.47 17.46,44.45 18.41,45.4 v18.41,58.1
  Bottom 0.152: v15.88,25.08 16.51,25.08 16.83,24.77 R47.2 | v17.78,37.15 v15.88,35.24 | v18.41,58.1 16.83,58.1 15.88,57.15 15.24,57.15 U1.10
A_CV  (via drill 0.25)
  Top 0.152: v17.78,45.72 v17.78,53.66
  Bottom 0.152: 34.29,45.4 36.51,45.4 R5.1 36.83,45.4 37.47,45.4 37.47,47.62 35.88,49.21 U2.1 | v17.78,53.66 18.1,53.66 18.1,54.93 U1.6 | v17.78,45.72 18.1,45.4 34.29,45.4 | 34.29,45.4 C12.2
A_GATE  (via drill 0.25)
  Top 0.152: v19.68,46.99 19.05,47.62 v19.05,61.91
  Bottom 0.152: v19.68,46.99 20.64,46.99 20.95,46.67 R10.2 | v19.05,61.91 19.05,63.18 U1.20
A_TRIG  (via drill 0.25)
  Top 0.152: v27.62,41.59 27.3,41.91 27.3,58.42 26.04,59.69 v26.04,61.59
  Bottom 0.152: v27.62,41.59 29.84,41.59 30.16,41.27 Q5.C | v26.04,61.59 25.72,61.91 23.81,61.91 U1.25
A_TRIG_IN  (via drill 0.25)
  Top 0.152: v36.2,34.29 37.47,35.56 J4.P3
  Bottom 0.152: v36.2,34.29 36.2,33.34 R67.1
ADC_TIME_SHAPE
  Bottom 0.152: IC3.3 8.26,65.09 8.26,63.18 7.62,63.18 7.3,62.87 7.3,57.78 10.16,57.78 11.43,56.52 14.92,56.52 U1.9
AREF_-2.5  (via drill 0.25, 0.35)
  Top 0.152: v13.65,78.42 v15.24,78.42 | 7.94,26.04 8.26,26.35 8.26,31.75 8.27,31.77 | 7.94,26.04 v5.71,23.81 | v11.11,24.77 9.21,24.77 7.94,26.04 | v34.29,1.59 7.94,1.59 7.94,10.79 7.62,11.11 7.62,16.83 7.94,17.14 7.94,26.04
  Top 0.406: v1.45,42.67 4.67,39.45 4.67,35.37 8.27,31.77 9.14,30.89 v9.14,28.96
  Bottom 0.152: 12.7,79.38 10.48,79.38 R29.2 10.16,79.69 8.89,80.96 7.62,80.96 C41.1 7.3,81.28 6.03,82.55 IC11.2 | v15.24,78.42 15.24,79.38 R53.2 | 12.7,79.38 v13.65,78.42 | 12.7,79.38 R28.2 | v5.71,23.81 3.49,23.81 3.49,23.5 1.59,21.59 R34.2 | R25.2 1.59,24.77 5.71,28.89 8.89,28.89 v9.14,28.96 | v11.11,24.77 13.97,24.77 R2.2 | v34.29,1.59 35.24,1.59 U$1.5
  Bottom 0.305: C41.1 4.62,78.36 3.04,78.36 0.89,76.22 0.89,69.69 1.27,69.31 1.27,42.85 v1.45,42.67
  Bottom 0.61: R1.2 10.1,87.12 9.11,86.13 6.57,86.13 5.8,85.36 5.8,83.34 IC11.2
B_ADC  (via drill 0.25)
  Top 0.152: v3.17,22.23 3.49,22.54 3.49,35.56 v3.81,35.88 | v14.92,39.69 16.83,39.69 16.83,40.96 14.92,42.86 14.92,44.77 15.56,45.4 15.56,54.61 13.65,56.52 v13.65,57.15
  Bottom 0.152: v3.17,22.23 3.49,22.23 4.13,22.86 R24.2 | v3.81,35.88 7.3,39.37 13.02,39.37 13.65,40.01 14.61,40.01 v14.92,39.69 | v13.65,57.15 14.29,57.78 14.92,57.78 U1.11
B_CV  (via drill 0.25)
  Top 0.152: v20.32,56.52 22.86,56.52 v22.86,55.56
  Bottom 0.152: C26.2 30.8,57.78 28.89,57.78 R26.1 28.57,57.47 28.57,54.93 28.26,54.93 U2.8 27.94,54.93 23.5,54.93 v22.86,55.56 | v20.32,56.52 17.46,56.52 17.46,55.24 U1.7
B_CV_IN
  Bottom 0.152: R6.2 14.92,30.48 14.92,26.99 J1.P3
B_GATE  (via drill 0.25)
  Top 0.152: v19.68,47.94 19.37,48.26 19.37,61.28 v19.68,61.59
  Bottom 0.152: v19.68,47.94 18.41,46.67 R14.2 | v19.68,61.59 19.68,63.18 U1.21
B_TRIG  (via drill 0.25)
  Top 0.152: v13.02,60.33 v13.02,42.86
  Bottom 0.152: v13.02,42.86 13.34,42.86 14.92,41.27 Q6.C | v13.02,60.33 14.92,60.33 U1.14
B_TRIG_IN
  Bottom 0.152: R68.1 14.61,33.34 14.61,35.88 J3.P3
C_ADC  (via drill 0.25)
  Top 0.152: v21.91,20 23.81,21.91 23.81,41.59 22.23,43.18 22.23,43.81 20.32,45.72 20.32,55.56 19.68,56.2 19.68,57.78 v20,58.1
  Bottom 0.152: v21.91,20 21.27,20.64 5.08,20.64 4.45,21.27 R33.2 | v20,58.1 19.37,58.74 15.24,58.74 U1.12
C_CV  (via drill 0.25)
  Top 0.152: v16.51,49.21 v16.51,53.34 | v25.4,49.21 26.04,49.85 v26.04,58.74
  Bottom 0.152: 35.88,57.78 36.83,57.78 C28.2 | 35.88,57.78 34.61,57.78 R52.1 34.29,57.78 31.75,60.33 27.62,60.33 v26.04,58.74 | v16.51,53.34 16.51,54.93 U1.8 | v16.51,49.21 16.83,49.53 24.45,49.53 24.77,49.21 v25.4,49.21 | 35.88,57.78 35.88,54.93 U2.14
C_GATE  (via drill 0.25)
  Top 0.152: v17.14,46.67 17.14,55.88 17.78,56.52 v17.78,60.64
  Bottom 0.152: v17.14,46.67 15.56,46.67 R20.2 | v17.78,60.64 18.1,60.96 20,60.96 20.32,61.28 20.32,63.18 U1.22
C_TRIG  (via drill 0.25)
  Top 0.152: v7.3,41.59 8.89,43.18 8.89,60.96 v10.16,62.23
  Bottom 0.152: v7.3,41.59 2.54,41.59 2.22,41.27 Q7.C | v10.16,62.23 10.48,62.55 13.02,62.55 14.29,61.28 14.92,61.28 U1.15
C_TRIG_IN
  Bottom 0.152: J6.P3 1.91,33.02 R66.1
GND  (via drill 0.35)  (25 unrouted)
  Top 0.152: v20.57,97.79 18.11,97.79 SW_B.2
  Bottom 0.152: v20.57,97.79 20.98,97.79 21.59,98.4 23.75,98.4 SW_C.2
  other vias: 33.27,66.04
  pour Bottom: 39.62,106.93 0,106.93 -0.76,106.17 -0.76,-0.25 0,-1.02 0.25,-1.02 38.86,-1.02 39.62,-0.25 39.62,106.68
  pour Top: 0,-1.78 39.37,-1.78 40.39,-0.76 40.39,107.19 39.62,107.95 -0.25,107.95 -2.03,106.17 -2.03,0.25
LEDS_SCK  (via drill 0.25)
  Top 0.152: v33.34,60.64 v33.34,61.91
  Bottom 0.152: v33.34,61.91 33.34,62.87 IC1.3 | v33.34,60.64 33.02,60.96 23.81,60.96 U1.26
LEDS_SIN
  Bottom 0.152: IC1.2 33.97,62.87 33.97,61.91 36.2,61.91 36.51,61.59 36.51,60.33 33.97,60.33 33.66,60.01 32.7,60.01 32.07,60.64 25.4,60.64 24.45,59.69 23.81,59.69 U1.28
N$1
  Bottom 0.152: R31.1 35.24,40.64 35.24,43.18 36.51,43.18 SLD_C.E
N$2
  Bottom 0.152: J12.P3 37.47,15.24 35.88,13.65 31.43,13.65 31.11,13.97 R7.1
N$3
  Bottom 0.61: D4.A 6.66,92.14 L1.2
N$4
  Bottom 0.61: L4.2 11.81,103.89 D3.C | D3.C 10.79,104.71 L5.2 | D3.C 11.37,105.49 27.69,105.49 28.39,104.78 C13.1 30.1,104.78 30.48,105.16 L3.1
N$5
  Bottom 0.508: IC7.3 22.17,103.89 L4.1 17.4,103.87 C20.1
N$6
  Bottom 0.152: IC9.13 14.29,14.92 14.92,14.92 IC9.14
N$7  (via drill 0.25)
  Top 0.152: v8.57,24.45 10.48,24.45 10.48,18.41 10.79,18.1 10.79,8.57 14.61,4.76 J8.P3
  Bottom 0.152: v8.57,24.45 7.62,24.45 R23.1 | R3.1 21.27,7.94 19.68,6.35 17.46,6.35 15.88,4.76 14.92,4.76 J8.P3
N$8
  Bottom 0.152: C2.1 10.16,23.18 7.62,23.18 R23.2 7.3,23.18 6.03,24.45 4.45,24.45 R24.1 4.13,24.45 2.86,24.45 1.59,23.18 R25.1 1.27,23.18 0.64,23.18 0.64,36.51 1.59,37.47 1.91,37.47 1.91,39.37 2.54,40.01 7.94,40.01 7.94,41.91 7.62,42.23 6.35,42.23 6.35,46.35 6.03,46.67 5.08,46.67 5.08,47.94 U4.6
N$9  (via drill 0.25)
  Top 0.152: v15.56,55.56 16.83,55.56 16.83,56.2 17.14,56.52 v17.14,57.47
  Bottom 0.152: v15.56,55.56 11.75,55.56 9.84,57.47 5.08,57.47 4.45,56.83 R21.1 | v17.14,57.47 20.95,57.47 21.27,57.15 21.27,55.24 U1.2
N$10  (via drill 0.25)
  Top 0.152: v13.65,58.1 16.51,58.1 v16.51,56.83
  Bottom 0.152: v13.65,58.1 11.43,58.1 R22.1 | v16.51,56.83 19.68,56.83 20,57.15 20.64,57.15 20.95,56.83 20.95,56.2 20.64,55.88 20.64,55.24 U1.3
N$11
  Bottom 0.152: R21.2 2.86,56.83 2.86,61.28 4.13,61.28 Q2.3 4.13,61.59 4.13,63.82 2.86,65.09 C35.2
N$12
  Bottom 0.152: C34.2 11.11,61.59 11.11,60.33 R22.2 11.11,60.01 10.16,59.05 8.57,59.05 Q2.1
N$13
  Bottom 0.152: R11.1 23.18,14.29 23.18,16.19 16.51,16.19 14.92,17.78 J10.P3
N$14
  Bottom 0.152: U4.13 10.16,53.34 11.11,53.34 U4.14
N$15  (via drill 0.25)
  Top 0.152: v13.65,10.79 13.34,11.11 13.34,21.27 | v11.11,23.5 13.34,21.27 | v12.38,49.53 12.38,37.47 13.34,36.51 13.34,31.11 13.02,30.8 13.02,27.62 13.34,27.3 13.34,21.27
  Bottom 0.152: v13.65,10.79 15.24,10.79 16.19,9.84 23.18,9.84 23.18,8.26 R3.2 | v11.11,23.5 10.16,24.45 C2.2 | v12.38,49.53 3.81,49.53 3.81,48.26 U4.7
N$16  (via drill 0.25)
  Top 0.152: v19.37,12.7 18.1,11.43 v18.1,8.89
  Bottom 0.152: 16.19,7.94 14.92,9.21 IC9.1 | 16.19,7.94 16.19,6.99 R8.1 | v19.37,12.7 27.62,12.7 28.89,13.97 R7.2 | v18.1,8.89 17.14,7.94 16.19,7.94
N$17  (via drill 0.25)
  Top 0.152: v6.35,21.27 4.76,19.68 4.76,7.62 1.91,4.76 J7.P3
  Bottom 0.152: R27.1 2.54,7.94 2.54,4.76 1.91,4.76 J7.P3 | v6.35,21.27 7.3,21.27 R32.1
N$18  (via drill 0.25)
  Top 0.152: v0.95,41.91 0.64,41.59 0.64,21.59 v2.54,19.68
  Bottom 0.152: R34.1 1.59,19.68 v2.54,19.68 4.13,19.68 R33.1 4.45,19.68 7.3,19.68 R32.2 7.62,19.68 10.16,19.68 C3.1 | v0.95,41.91 3.81,41.91 3.81,43.81 2.86,44.77 2.86,54.61 3.17,54.93 4.76,54.93 4.76,53.66 U4.9
N$19  (via drill 0.25)
  Top 0.152: v3.81,10.16 4.45,10.79 4.45,20.32 v6.35,22.23 | v3.81,50.16 6.35,47.62 6.35,38.42 7.94,36.83 7.94,33.02 10.79,30.16 10.79,26.04 11.75,25.08 v11.75,23.81
  Bottom 0.152: v3.81,10.16 2.86,10.16 0.95,8.26 R27.2 | 9.53,22.23 v6.35,22.23 | 9.53,22.23 10.16,21.59 C3.2 | v3.81,50.16 3.81,53.34 U4.8 | v11.75,23.81 11.75,22.23 9.53,22.23
N$20
  Bottom 0.152: J11.P3 2.86,17.78 2.86,14.29 R15.1
N$21
  Bottom 0.152: R51.2 1.59,30.16 1.59,26.99 1.91,26.99 J5.P3
N$22  (via drill 0.25)
  Top 0.152: v37.15,29.53 37.47,29.21 J2.P3
  Bottom 0.152: v37.15,29.53 36.2,30.48 R4.2
N$24
  Bottom 0.152: 13.65,6.99 13.65,9.21 IC9.3 | 13.65,6.99 14.61,6.99 R8.2 | 13.65,6.99 13.65,3.81 15.56,1.91 R9.1
N$25  (via drill 0.25)
  Top 0.152: v21.59,9.21 28.57,16.19 28.57,22.54 31.11,25.08 31.11,39.69 27.94,42.86 27.94,46.04 v28.26,46.35
  Bottom 0.152: v21.59,9.21 21.27,9.53 15.88,9.53 14.92,10.48 14.29,10.48 14.29,9.53 IC9.2 | v28.26,46.35 27.94,46.67 23.81,46.67 22.23,48.26 21.27,48.26 R10.1
N$26
  Bottom 0.152: IC9.7 11.11,9.53 7.62,9.53 6.99,8.89 R12.1 6.67,8.89 5.08,8.89 5.08,11.43 6.03,12.38 8.57,12.38 9.53,13.34 20.64,13.34 21.27,13.97 R11.2
N$28
  Bottom 0.152: IC9.5 12.38,9.21 11.75,8.57 8.57,8.57 R12.2 8.26,8.57 8.26,4.13 9.21,3.17 10.48,3.17 11.75,1.91 R13.1
N$29  (via drill 0.25)
  Top 0.152: v14.92,11.43 17.46,13.97 17.46,27.94 17.78,28.26 17.78,35.56 17.14,36.2 17.14,45.72 16.51,46.35 v16.51,47.31
  Bottom 0.152: v14.92,11.43 11.75,11.43 11.75,9.53 IC9.6 | v16.51,47.31 17.46,48.26 18.1,48.26 R14.1
N$30
  Bottom 0.152: IC9.8 11.11,14.92 10.79,15.24 8.57,15.24 R16.1 8.26,15.24 6.03,15.24 4.13,13.34 1.91,13.34 1.27,13.97 R15.2
N$32  (via drill 0.25)
  Top 0.152: v27.62,79.06 v27.62,64.14
  Bottom 0.152: v27.62,64.14 28.26,64.14 28.26,63.18 IC1.11 | v27.62,79.06 24.77,81.92 23.5,81.92 15.88,89.53 15.88,99.38 17.14,99.38 MODE_B.GREEN_C
N$33  (via drill 0.25)
  Top 0.152: v26.99,82.23 v26.99,68.9
  Bottom 0.152: v26.99,68.9 23.5,68.9 23.5,65.72 24.45,64.77 28.89,64.77 28.89,63.18 IC1.10 | v26.99,82.23 26.35,82.87 26.35,89.53 21.59,89.53 16.19,94.93 16.19,98.74 17.78,98.74 18.1,99.06 18.1,100.33 15.24,100.33 MODE_A.RED_C
N$34  (via drill 0.25)
  Top 0.152: v26.35,64.14 26.35,97.47 25.08,98.74 22.54,98.74 22.54,99.38 MODE_B.RED_C
  Bottom 0.152: v26.35,64.14 26.67,64.14 27.62,63.18 IC1.12
N$35  (via drill 0.25)
  Top 0.152: v28.57,65.41 28.89,65.72 28.89,74.93 28.26,75.56 28.26,80.96 30.48,83.19 30.48,87.95 28.26,90.17 28.26,98.11 MODE_C.RED_C
  Bottom 0.152: v28.57,65.41 30.8,65.41 30.8,63.18 IC1.7
N$36  (via drill 0.25)
  Top 0.152: v30.16,64.77 29.53,65.41 29.53,75.56 28.89,76.2 28.89,80.33 31.11,82.55 31.11,99.38 30.16,100.33 24.77,100.33 24.77,99.69 MODE_C.GREEN_C
  Bottom 0.152: v30.16,64.77 30.16,63.18 IC1.8
N$37  (via drill 0.25)  (1 unrouted)
  Top 0.152: v30.48,70.17 32.7,67.94 v32.7,44.77 | v35.88,38.42 35.56,38.1 35.56,32.07 36.2,31.43 36.2,15.56 37.15,14.61 v37.15,13.97 | 17.46,11.75 17.46,11.43 LED11.RED_C
  Bottom 0.152: v30.48,70.17 28.89,70.17 28.89,68.58 IC1.15 | v32.7,44.77 32.7,42.23 33.02,42.23 33.97,41.27 33.97,38.42 v35.88,38.42 | v37.15,13.97 35.24,12.06 18.41,12.06 v18.1,12.38
N$38  (via drill 0.25)
  Top 0.152: v24.13,66.04 24.13,44.45 26.35,42.23 v26.35,41.59 | v29.53,28.26 28.57,27.3 28.57,23.18 23.81,18.41 23.81,12.7 22.54,11.43 LED11.GREEN_C
  Bottom 0.152: v24.13,66.04 29.53,66.04 29.53,68.26 IC1.16 | v26.35,41.59 27.94,40.01 31.75,40.01 35.24,36.51 35.24,32.07 33.34,32.07 v29.53,28.26
N$39  (via drill 0.25)
  Top 0.152: v26.99,67.63 26.99,62.87 28.26,61.59 v28.26,51.12 | v26.67,50.8 26.99,50.48 v26.99,38.1 | v9.21,23.81 8.26,22.86 8.26,11.75 8.57,11.43 LED10.GREEN_C
  Bottom 0.152: v26.99,67.63 27.62,68.26 IC1.13 | v28.26,51.12 27.94,50.8 v26.67,50.8 | v26.99,38.1 28.57,36.51 28.57,29.21 16.83,29.21 16.19,28.57 16.19,25.72 9.53,25.72 9.21,25.4 v9.21,23.81
N$40  (via drill 0.25)
  Top 0.152: v30.16,69.53 32.07,67.63 32.07,44.45 32.7,43.81 v32.7,41.59 | v32.7,40.01 31.43,38.73 31.43,11.43 LED12.RED_C
  Bottom 0.152: v30.16,69.53 30.16,68.58 IC1.17 | v32.7,40.01 v32.7,41.59
N$41
  Bottom 0.152: R69.2 7.94,33.66 6.03,33.66 D1.C 5.71,33.66 4.45,33.66 3.81,33.02 R66.2 3.17,33.02 3.17,38.73 Q7.B
N$42  (via drill 0.25)
  Top 0.152: v30.8,66.67 31.11,66.36 31.11,45.4 30.48,44.77 30.48,44.13 30.16,43.81 30.16,43.18 32.7,40.64 34.61,40.64 34.61,19.37 35.88,18.1 35.88,15.24 36.51,14.61 36.51,11.43 LED12.GREEN_C
  Bottom 0.152: v30.8,66.67 30.8,68.26 IC1.18
N$43  (via drill 0.25)
  Top 0.152: v28.26,66.67 27.94,66.36 27.94,64.77 28.89,63.82 v28.89,47.94 | v26.35,43.5 v26.35,47.31 | v6.99,31.11 3.81,27.94 3.81,11.43 LED10.RED_C
  Bottom 0.152: v28.26,66.67 28.26,68.26 IC1.14 | v28.89,47.94 28.26,47.31 v26.35,47.31 | v26.35,43.5 24.13,41.27 24.13,36.83 23.81,36.51 23.81,31.43 9.53,31.43 8.89,30.8 7.3,30.8 v6.99,31.11
N$44
  Bottom 0.152: 30.48,72.07 31.11,71.44 C8.1 | 30.48,72.07 30.16,72.39 29.84,72.39 29.53,72.71 L2.1 | 30.48,72.07 34.29,72.07 | 34.29,72.07 37.78,72.07 37.78,68.9 37.47,68.58 34.61,68.58 IC1.24 | 34.29,72.07 34.29,70.99 C7.1
N$45  (via drill 0.25)
  Top 0.152: v31.43,44.77 v31.43,66.99
  Bottom 0.152: v31.43,66.99 31.43,68.26 IC1.19 | v31.43,44.77 31.11,45.09 10.16,45.09 8.89,43.81 8.89,39.69 10.79,39.69 11.75,40.64 R19.2
N$46  (via drill 0.25)
  Top 0.152: v30.48,66.04 30.8,65.72 30.8,45.72 29.84,44.77 v29.84,44.45
  Bottom 0.152: v30.48,66.04 32.07,66.04 32.07,68.26 IC1.20 | v29.84,44.45 29.53,44.77 28.57,44.77 25.08,41.27 25.08,40.64 R30.2
N$47
  Bottom 0.152: R31.2 38.1,40.64 38.1,61.91 36.2,63.82 31.43,63.82 31.43,63.18 IC1.6
N$48  (via drill 0.25)
  Top 0.152: v7.94,62.55 2.86,57.47 2.86,43.5 SLD_A.2
  Bottom 0.152: v7.94,62.55 9.53,62.55 9.53,65.09 IC3.1
N$49
  Bottom 0.152: R30.1 23.5,40.64 23.5,43.18 SLD_B.E
N$50
  Bottom 0.152: R19.1 10.16,40.64 10.16,43.18 SLD_A.E
N$51  (via drill 0.25)
  Top 0.152: v13.02,67.94 13.34,68.26 13.34,70.48 19.68,76.83 POT_B.P$2
  Bottom 0.152: v13.02,67.94 8.89,67.94 8.89,65.41 IC3.2
N$53
  Bottom 0.152: IC3.12 6.99,71.12 6.99,71.75 4.76,71.75 3.81,70.8 3.81,69.53 1.59,69.53 1.27,69.85 1.27,75.88 5.4,75.88 6.35,76.83 POT_A.P$2
N$54  (via drill 0.25)
  Top 0.152: v12.38,71.44 15.88,74.93 v15.88,78.11
  Bottom 0.152: IC3.13 7.62,69.85 10.79,69.85 v12.38,71.44 | v15.88,78.11 16.19,78.42 31.43,78.42 32.7,77.15 POT_C.P$2
N$55  (via drill 0.25)
  Top 0.152: v10.48,70.48 11.11,69.85 v11.11,51.75 | v22.23,50.48 22.54,50.16 v22.54,46.99 | v28.89,46.04 28.89,43.5 SLD_C.2
  Bottom 0.152: v10.48,70.48 10.16,70.17 8.26,70.17 8.26,70.8 IC3.14 | v11.11,51.75 12.7,50.16 21.91,50.16 v22.23,50.48 | v22.54,46.99 23.81,45.72 28.57,45.72 v28.89,46.04
N$56  (via drill 0.25)
  Top 0.152: v10.48,71.75 11.75,70.48 v11.75,44.45
  Bottom 0.152: v10.48,71.75 8.89,71.75 8.89,71.12 IC3.15 | v11.75,44.45 12.7,43.5 15.88,43.5 SLD_B.2
N$57  (via drill 0.25)
  Top 0.152: v35.24,31.43 v35.24,46.04 35.24,73.66 36.51,74.93 36.51,78.11 34.99,79.63 34.99,105.86 16.95,105.86 10.86,99.76 10.86,90.23 8.13,87.5 8.13,83.31 v8.89,82.55
  Bottom 0.152: v35.24,31.43 34.61,31.43 34.61,30.48 R4.1 | v8.89,82.55 10.16,81.28 R29.1 | R5.2 36.51,46.67 35.88,46.04 v35.24,46.04 34.29,46.99 C12.1 34.29,49.21 U2.2
N$58  (via drill 0.25)
  Top 0.152: v24.45,31.11 28.57,35.24 28.57,41.59 27.62,42.55 v27.62,59.05 27.62,61.59 25.72,63.5 25.72,79.38 22.23,82.87 22.23,84.45 23.5,85.72 23.5,98.42 13.65,98.42 13.02,97.79 v13.02,82.23
  Bottom 0.152: v24.45,31.11 17.46,31.11 16.83,30.48 R6.1 | v27.62,59.05 28.57,59.05 R26.2 28.89,59.37 30.8,59.37 C26.1 31.11,59.37 31.75,59.37 31.75,57.15 31.43,56.83 29.53,56.83 29.53,54.93 U2.9 | v13.02,82.23 13.02,81.28 R28.1
N$59  (via drill 0.25)
  Top 0.152: v13.65,47.94 v13.65,30.48 | v25.08,49.85 25.4,50.16 v25.4,52.39 25.4,78.74 v25.08,79.06
  Bottom 0.152: 36.83,59.37 34.61,59.37 R52.2 | v13.65,30.48 3.17,30.48 R51.1 | v13.65,47.94 15.56,49.85 v25.08,49.85 | v25.4,52.39 33.02,52.39 33.97,53.34 | 33.97,53.34 34.29,53.66 34.29,54.61 U2.13 | v25.08,79.06 17.46,79.06 15.56,80.96 R53.1 | 36.83,59.37 37.78,58.42 37.78,53.34 33.97,53.34 | 36.83,59.37 C28.1
N$61
  Bottom 0.152: IC9.10 12.38,14.61 11.43,13.65 8.57,13.65 R16.2 8.26,13.34 4.76,13.34 4.76,3.81 5.71,2.86 6.35,2.86 7.3,1.91 R17.1
N$62
  Bottom 0.152: R71.2 20.64,32.38 19.37,33.66 18.73,33.66 D5.C 18.41,33.66 18.1,33.34 16.51,33.34 R68.2 16.19,33.02 15.56,32.38 13.65,32.38 13.65,36.51 15.88,38.73 Q6.B
N$64  (via drill 0.25)
  Top 0.152: v21.59,15.56 21.27,15.88 21.27,36.51 21.91,37.15 v21.91,42.23 | v22.54,44.45 23.18,45.09 v23.18,48.26
  Bottom 0.152: v21.59,15.56 21.27,15.88 11.75,15.88 11.75,14.92 IC9.9 | v21.91,42.23 21.91,42.55 22.23,42.86 22.23,44.45 v22.54,44.45 | v23.18,48.26 22.23,49.21 17.46,49.21 16.83,48.58 15.56,48.58 R20.1
N$65
  Bottom 0.152: R67.2 34.29,33.34 32.38,33.34 D2.C 32.07,33.66 31.11,33.66 | 31.11,33.66 29.84,33.66 R70.2 | 31.11,33.66 31.11,38.73 Q5.B
N$66
  Bottom 0.61: C15.1 35.69,105.16 L3.2 33.51,103.36 IC2.1
N$68
  Bottom 0.152: IC1.23 33.97,68.58 33.97,69.53 36.83,69.53 R50.1
N$86  (via drill 0.25)
  Top 0.152: v32.07,15.24 33.02,14.29 33.02,9.21 37.47,4.76 J9.P3
  Bottom 0.152: v32.07,15.24 23.81,15.24 23.81,19.05 20,22.86 R41.1 | R35.1 38.42,7.94 38.42,4.76 37.47,4.76 J9.P3
N$87  (via drill 0.25)
  Top 0.152: v14.29,46.35 13.97,46.04 13.97,38.73 16.51,36.2 v16.51,21.91
  Bottom 0.152: 16.51,23.18 16.83,23.18 R47.1 | 16.51,23.18 14.29,23.18 R2.1 | C1.1 22.54,23.18 21.27,24.45 20,24.45 R41.2 19.68,24.45 18.41,24.45 17.14,23.18 R47.1 | v14.29,46.35 10.16,46.35 10.16,47.94 U4.2 | 16.51,23.18 v16.51,21.91 | 16.51,23.18 R47.1
N$93  (via drill 0.25)
  Top 0.152: v33.34,19.68 34.61,18.41 v34.61,10.16 | v14.29,47.31 14.92,46.67 14.92,46.04 14.29,45.4 14.29,39.05 16.83,36.51 16.83,28.89 v17.14,28.57
  Bottom 0.152: v33.34,19.68 27.62,19.68 22.86,24.45 C1.2 22.54,24.77 21.27,24.77 21.27,27.3 20,28.57 v17.14,28.57 | v34.61,10.16 36.51,8.26 R35.2 | v14.29,47.31 12.06,47.31 11.43,47.94 U4.1
N$101  (via drill 0.25)
  Top 0.152: MODE_A.GREEN_C 9.53,99.69 9.53,106.17 35.31,106.17 35.31,79.76 36.83,78.23 36.83,74.61 37.78,73.66 37.78,72.9 37.25,72.37 36.08,72.37 36.06,72.39 35.56,72.39 35.56,61.59 v35.88,61.28
  Bottom 0.152: v35.88,61.28 29.53,61.28 29.53,62.87 IC1.9
N_U
  Bottom 0.152: U2.7 28.26,49.53 29.21,49.53 U2.6
POTS_ADDR_A  (via drill 0.25)
  Top 0.152: v12.38,60.01 v12.38,69.53
  Bottom 0.152: v12.38,69.53 6.35,69.53 6.35,70.8 IC3.11 | v12.38,60.01 12.7,59.69 14.92,59.69 U1.13
POTS_ADDR_B  (via drill 0.25)
  Top 0.152: v13.97,68.9 17.14,65.72 v17.14,64.77
  Bottom 0.152: v13.97,68.9 5.71,68.9 5.71,70.8 IC3.10 | v17.14,64.77 17.14,63.5 U1.18
POTS_ADDR_C  (via drill 0.25)
  Top 0.152: v13.97,67.94 16.51,65.41 16.51,64.45 16.83,64.14 18.1,64.14 v18.1,64.77
  Bottom 0.152: v13.97,67.94 13.34,68.58 5.08,68.58 5.08,70.8 IC3.9 | v18.1,64.77 18.1,63.5 U1.19
RESET  (via drill 0.25)
  Top 0.152: v22.86,51.12 23.5,51.75 23.5,52.7 | 23.5,52.7 23.5,69.22 22.86,69.85 JP6.4 | 23.5,52.7 v22.86,52.7
  Bottom 0.152: U1.4 19.68,54.93 19.68,53.98 20.95,52.7 C36.1 21.27,52.7 v22.86,52.7 | v22.86,51.12 23.81,51.12 R18.2
SW_MODE_A  (via drill 0.25)
  Top 0.152: v22.23,60.64 21.59,61.28 21.59,73.98 23.5,75.88 23.5,80.33 14.29,89.53 14.29,90.49 SW_A.3 14.29,90.81 14.29,97.16 SW_A.4
  Bottom 0.152: v22.23,60.64 23.5,60.64 U1.27
SW_MODE_B  (via drill 0.25)
  Top 0.152: v24.77,59.05 24.77,78.42 23.81,79.38 23.81,80.64 21.91,82.55 21.91,90.49 SW_B.3 22.23,90.81 22.23,97.16 SW_B.4
  Bottom 0.152: v24.77,59.05 23.81,59.05 U1.29
SW_MODE_C  (via drill 0.25)
  Top 0.152: v29.53,58.42 29.21,58.74 29.21,75.25 28.57,75.88 28.57,80.64 30.8,82.87 30.8,89.22 29.53,90.49 SW_C.3 29.53,90.81 29.53,97.16 SW_C.4
  Bottom 0.152: v29.53,58.42 27.94,58.42 27.62,58.1 23.81,58.1 U1.30
SWCLK  (via drill 0.25)
  Top 0.152: v20.95,65.09 20.32,65.72 JP6.3
  Bottom 0.152: v20.95,65.09 21.91,65.09 21.91,63.5 U1.24
SWDIO  (via drill 0.25)
  Top 0.152: v18.41,65.41 17.78,66.04 JP6.2
  Bottom 0.152: v18.41,65.41 19.37,64.45 21.27,64.45 21.27,63.5 U1.23
VCC  (via drill 0.25)
  Top 0.152: v7.3,46.67 8.57,47.94 8.57,64.77 | v8.57,75.56 8.57,64.77 | v13.02,8.57 14.29,9.84 14.29,16.51 13.65,17.14 v13.65,28.57 | v12.38,29.84 10.79,31.43 10.79,42.55 11.43,43.18 11.43,43.81 10.48,44.77 10.48,61.59 10.79,61.91 10.79,62.55 8.57,64.77
  Bottom 0.152: IC9.4 13.02,9.21 v13.02,8.57 13.02,6.99 C4.1 13.02,6.67 13.34,6.67 13.34,4.13 13.02,3.81 13.02,0.95 26.67,0.95 26.99,1.27 U$1.1 | C50.1 7.3,45.72 v7.3,46.67 7.3,47.94 U4.4 | v8.57,75.56 8.89,75.88 12.7,75.88 14.29,77.47 14.48,77.47 | v12.38,29.84 v13.65,28.57
  Bottom 0.61: C14.1 L5.1 10.65,101.72 C21.1 11.3,100.32 10.96,99.97 10.96,99.16 11.43,98.69 11.43,90.93 13.97,88.65 14.99,88.65 14.99,86.31 13.35,84.67 13.35,82.97 14.48,81.83 14.48,77.47
VEE  (via drill 0.25)
  Top 0.152: v22.23,3.17 20.95,4.45 v20.95,37.15 | v16.19,40.64 14.61,42.23 14.61,45.09 15.24,45.72 15.24,51.12 v13.65,52.7 | v5.4,86.04 5.4,75.25 2.22,72.07 v2.22,55.56
  Bottom 0.152: 7.94,54.93 7.94,53.66 7.62,53.66 U4.11 | 7.94,54.93 7.94,55.56 | 7.94,55.56 7.94,56.52 C23.2 | v22.23,3.17 27.62,3.17 29.21,1.59 U$1.2 | v20.95,37.15 17.46,40.64 v16.19,40.64 | v13.65,52.7 11.43,54.93 7.94,54.93 | v5.4,86.04 5.4,87.63 C18.2 | 7.94,55.56 v2.22,55.56
  Bottom 0.61: L1.1 2.81,90.54 C16.2 5.46,87.88 C18.2 6.17,87.88 7.52,89.24 11.69,89.24 R1.1